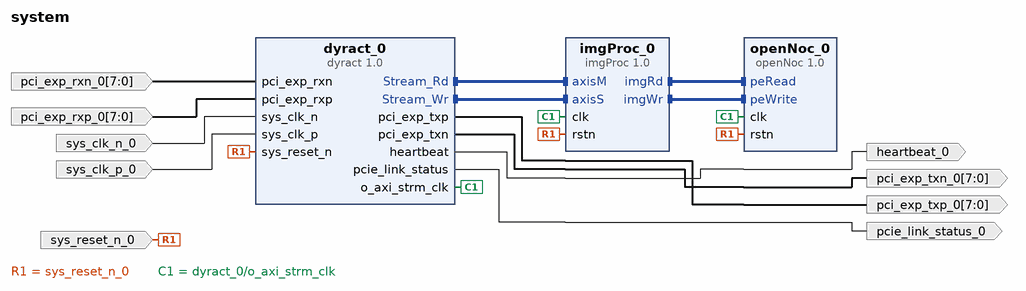
[diagram p0: block diagram of the top level]
# Vivado block design system, xc7vx690tffg1761-2, Vivado 2018.2
create_bd_design system

create_bd_port -dir I -from 7 -to 0 pci_exp_rxn_0
create_bd_port -dir I -from 7 -to 0 pci_exp_rxp_0
create_bd_port -dir O -from 7 -to 0 pci_exp_txp_0
create_bd_port -dir O -from 7 -to 0 pci_exp_txn_0
create_bd_port -dir I -type clk sys_clk_n_0
create_bd_port -dir I -type clk sys_clk_p_0
create_bd_port -dir I sys_reset_n_0
create_bd_port -dir O pcie_link_status_0
create_bd_port -dir O heartbeat_0

create_bd_cell -type ip -vlnv Kuladeep:user:imgProc:1.0 imgProc_0
create_bd_cell -type ip -vlnv xilinx.com:user:dyract:1.0 dyract_0
create_bd_cell -type ip -vlnv Kuladeep:user:openNoc:1.0 openNoc_0
set_property -dict {CONFIG.X 8 CONFIG.Y 8 CONFIG.data_width 256 CONFIG.pkt_no_field_size 12} [get_bd_cells openNoc_0]

# ---- connections ----

connect_bd_intf_net [get_bd_intf_pins imgProc_0/imgRd] [get_bd_intf_pins openNoc_0/peRead]
connect_bd_intf_net [get_bd_intf_pins imgProc_0/imgWr] [get_bd_intf_pins openNoc_0/peWrite]
connect_bd_intf_net [get_bd_intf_pins dyract_0/Stream_Rd] [get_bd_intf_pins imgProc_0/axisM]
connect_bd_intf_net [get_bd_intf_pins dyract_0/Stream_Wr] [get_bd_intf_pins imgProc_0/axisS]
connect_bd_net -net pci_exp_rxn_0_1 [get_bd_ports pci_exp_rxn_0] [get_bd_pins dyract_0/pci_exp_rxn]
connect_bd_net -net pci_exp_rxp_0_1 [get_bd_ports pci_exp_rxp_0] [get_bd_pins dyract_0/pci_exp_rxp]
connect_bd_net [get_bd_pins dyract_0/pci_exp_txp] [get_bd_ports pci_exp_txp_0]
connect_bd_net [get_bd_pins dyract_0/pci_exp_txn] [get_bd_ports pci_exp_txn_0]
connect_bd_net -net sys_clk_n_0_1 [get_bd_ports sys_clk_n_0] [get_bd_pins dyract_0/sys_clk_n]
connect_bd_net -net sys_clk_p_0_1 [get_bd_ports sys_clk_p_0] [get_bd_pins dyract_0/sys_clk_p]
connect_bd_net -net sys_reset_n_0_1 [get_bd_ports sys_reset_n_0] \
  [get_bd_pins dyract_0/sys_reset_n] [get_bd_pins imgProc_0/rstn] [get_bd_pins openNoc_0/rstn]
connect_bd_net [get_bd_pins dyract_0/o_axi_strm_clk] [get_bd_pins imgProc_0/clk] [get_bd_pins openNoc_0/clk]
connect_bd_net [get_bd_pins dyract_0/pcie_link_status] [get_bd_ports pcie_link_status_0]
connect_bd_net [get_bd_pins dyract_0/heartbeat] [get_bd_ports heartbeat_0]

validate_bd_design
save_bd_design
